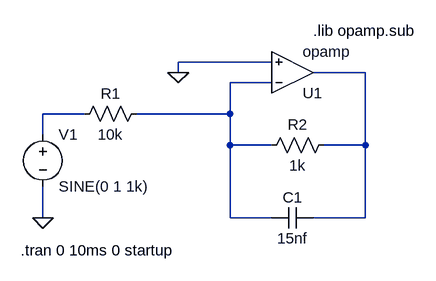
[diagram p0: schematic Integrating_circuit.asc]
Integrating_circuit.asc, the LTspice schematic file:
Version 4
SHEET 1 880 680
WIRE 256 128 112 128
WIRE 112 144 112 128
WIRE 400 144 320 144
WIRE 256 160 192 160
WIRE -32 208 -96 208
WIRE 192 208 192 160
WIRE 192 208 48 208
WIRE -96 240 -96 208
WIRE 192 256 192 208
WIRE 256 256 192 256
WIRE 400 256 400 144
WIRE 400 256 336 256
WIRE -96 368 -96 320
WIRE 192 368 192 256
WIRE 256 368 192 368
WIRE 400 368 400 256
WIRE 400 368 320 368
FLAG 112 144 0
FLAG -96 368 0
SYMBOL voltage -96 224 R0
WINDOW 123 0 0 Left 0
WINDOW 39 0 0 Left 0
SYMATTR InstName V1
SYMATTR Value SINE(0 1 1k)
SYMBOL res 64 192 R90
WINDOW 0 0 56 VBottom 2
WINDOW 3 32 56 VTop 2
SYMATTR InstName R1
SYMATTR Value 10k
SYMBOL res 352 240 R90
WINDOW 0 0 56 VBottom 2
WINDOW 3 32 56 VTop 2
SYMATTR InstName R2
SYMATTR Value 1k
SYMBOL cap 320 352 R90
WINDOW 0 0 32 VBottom 2
WINDOW 3 32 32 VTop 2
SYMATTR InstName C1
SYMATTR Value 15nf
SYMBOL Opamps\\opamp 288 208 M180
SYMATTR InstName U1
TEXT -130 418 Left 2 !.tran 0 10ms 0 startup
TEXT 320 80 Left 2 !.lib opamp.sub

The netlist it stands for:
* Integrating_circuit.asc
V1 N003 0 SINE(0 1 1k)
R1 N002 N003 10k
R2 N001 N002 1k
C1 N001 N002 15nf
XU1 N002 0 N001 opamp Aol=100K GBW=10Meg  ; pins invin noninvin out
.tran 0 10ms 0 startup
.lib opamp.sub
.backanno
.end